# Altium schematic sheet [1] NAND FLASH and SDRAM.SchDoc
size A4
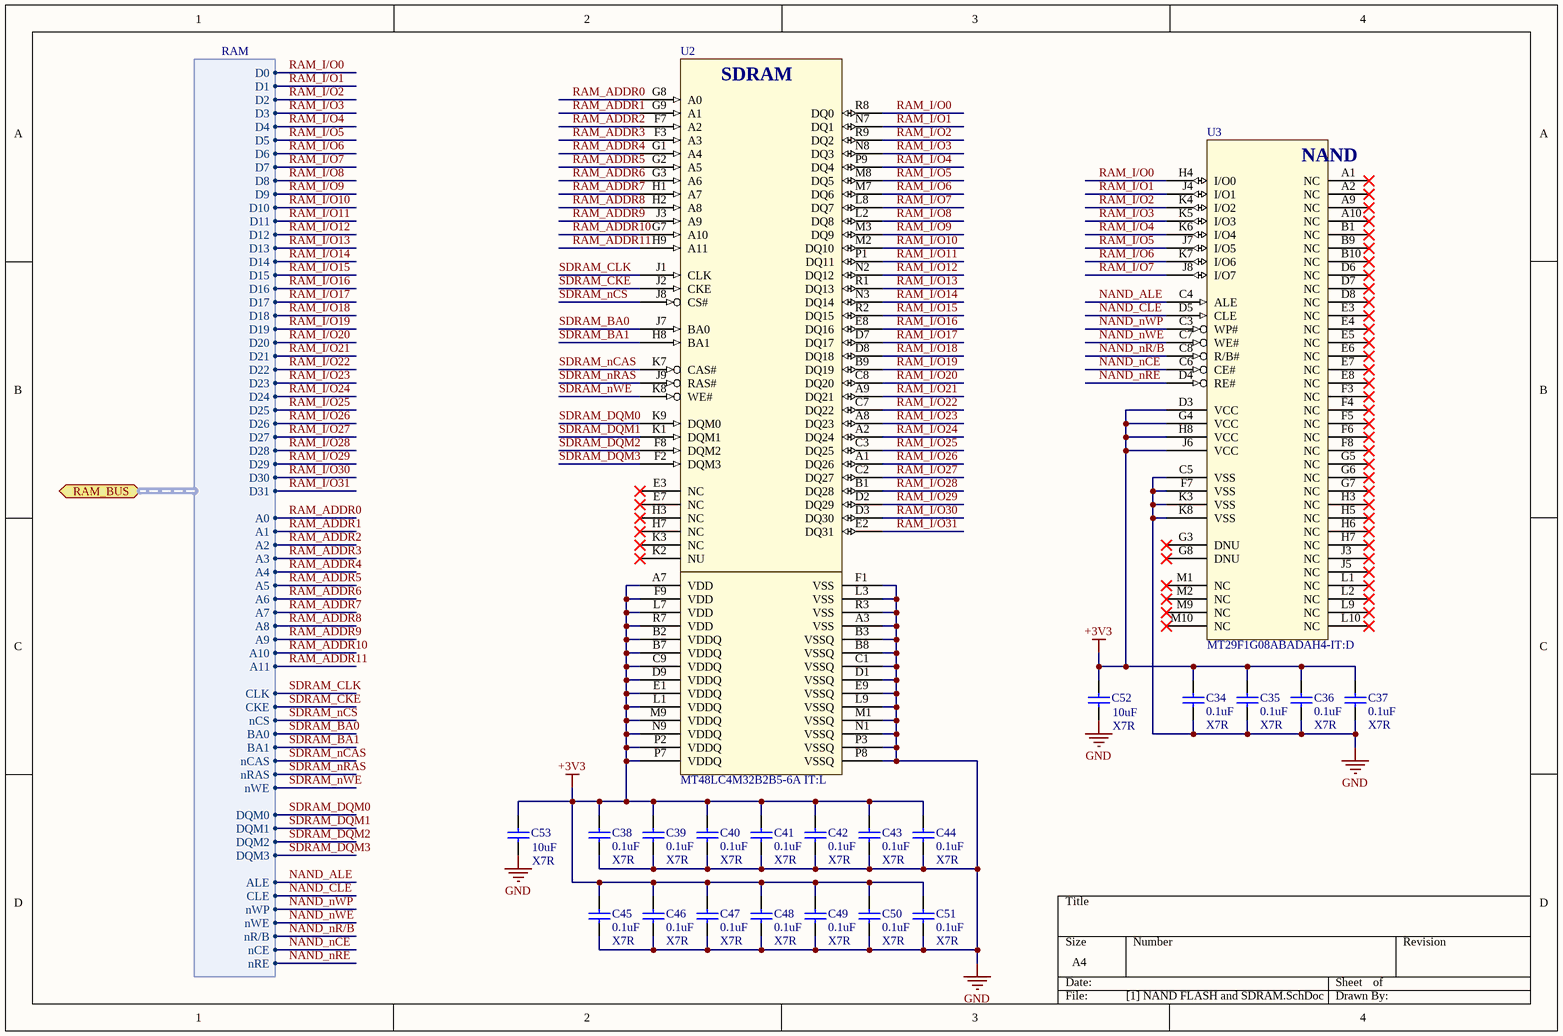
[diagram p0: [1] NAND FLASH and SDRAM.SchDoc]

## Parts
C34  value 0.1uF  Type: X7R  [CAP0201]  (hidden comment: ChipCap 0.1u X7R)
C35  value 0.1uF  Type: X7R  [CAP0201]  (hidden comment: ChipCap 0.1u X7R)
C36  value 0.1uF  Type: X7R  [CAP0201]  (hidden comment: ChipCap 0.1u X7R)
C37  value 0.1uF  Type: X7R  [CAP0201]  (hidden comment: ChipCap 0.1u X7R)
C38  value 0.1uF  Type: X7R  [CAP0201]  (hidden comment: ChipCap 0.1u X7R)
C39  value 0.1uF  Type: X7R  [CAP0201]  (hidden comment: ChipCap 0.1u X7R)
C40  value 0.1uF  Type: X7R  [CAP0201]  (hidden comment: ChipCap 0.1u X7R)
C41  value 0.1uF  Type: X7R  [CAP0201]  (hidden comment: ChipCap 0.1u X7R)
C42  value 0.1uF  Type: X7R  [CAP0201]  (hidden comment: ChipCap 0.1u X7R)
C43  value 0.1uF  Type: X7R  [CAP0201]  (hidden comment: ChipCap 0.1u X7R)
C44  value 0.1uF  Type: X7R  [CAP0201]  (hidden comment: ChipCap 0.1u X7R)
C45  value 0.1uF  Type: X7R  [CAP0201]  (hidden comment: ChipCap 0.1u X7R)
C46  value 0.1uF  Type: X7R  [CAP0201]  (hidden comment: ChipCap 0.1u X7R)
C47  value 0.1uF  Type: X7R  [CAP0201]  (hidden comment: ChipCap 0.1u X7R)
C48  value 0.1uF  Type: X7R  [CAP0201]  (hidden comment: ChipCap 0.1u X7R)
C49  value 0.1uF  Type: X7R  [CAP0201]  (hidden comment: ChipCap 0.1u X7R)
C50  value 0.1uF  Type: X7R  [CAP0201]  (hidden comment: ChipCap 0.1u X7R)
C51  value 0.1uF  Type: X7R  [CAP0201]  (hidden comment: ChipCap 0.1u X7R)
C52  value 10uF  Type: X7R  [CAP0805]  (hidden comment: ChipCap 10u X7R)
C53  value 10uF  Type: X7R  [CAP0805]  (hidden comment: ChipCap 10u X7R)
U2  MT48LC4M32B2B5-6A IT:L  [VFBGA-90]
U3  MT29F1G08ABADAH4-IT:D  [VFBGA-63 (H4 9x11)]

## Ports
RAM_BUS (harness RAM)

## Harnesses
RAM: D0, D1, D2, D3, D4, D6, D7, D8, D9, D10, D11, D12, D13, D14, D15, D16, D17, D18, D19, D20, D21, D22, D23, D24, D25, D26, D27, D28, D29, D30, D31, A0, A1, A2, A3, A4, A5, A6, A7, A8, A9, A10, A11, CLK, CKE, nCS, BA0, BA1, nCAS, nRAS, nWE, DQM0, DQM1, DQM2, DQM3, ALE, CLE, nWP, nWE, nR/B, nCE, nRE, D5

## Nets
+3V3: C34.2 C35.2 C36.2 C37.2 C38.2 C39.2 C40.2 C41.2 C42.2 C43.2 C44.2 C45.2 C46.2 C47.2 C48.2 C49.2 C50.2 C51.2 C52.2 C53.2 U2.A7(VDD) U2.B2(VDDQ) U2.B7(VDDQ) U2.C9(VDDQ) U2.D9(VDDQ) U2.E1(VDDQ) U2.F9(VDD) U2.L1(VDDQ) U2.L7(VDD) U2.M9(VDDQ) U2.N9(VDDQ) U2.P2(VDDQ) U2.P7(VDDQ) U2.R7(VDD) U3.D3(VCC) U3.G4(VCC) U3.H8(VCC) U3.J6(VCC)
GND: C34.1 C35.1 C36.1 C37.1 C38.1 C39.1 C40.1 C41.1 C42.1 C43.1 C44.1 C45.1 C46.1 C47.1 C48.1 C49.1 C50.1 C51.1 C52.1 C53.1 U2.A3(VSS) U2.B3(VSSQ) U2.B8(VSSQ) U2.C1(VSSQ) U2.D1(VSSQ) U2.E9(VSSQ) U2.F1(VSS) U2.L3(VSS) U2.L9(VSSQ) U2.M1(VSSQ) U2.N1(VSSQ) U2.P3(VSSQ) U2.P8(VSSQ) U2.R3(VSS) U3.C5(VSS) U3.F7(VSS) U3.K3(VSS) U3.K8(VSS)
NAND_ALE: U3.C4(ALE) ; port RAM_BUS.ALE
NAND_CLE: U3.D5(CLE) ; port RAM_BUS.CLE
NAND_nCE: U3.C6(CE#) ; port RAM_BUS.nCE
NAND_nR/B: U3.C8(R/B#) ; port RAM_BUS.nR/B
NAND_nRE: U3.D4(RE#) ; port RAM_BUS.nRE
NAND_nWE: U2.K8(WE#) U3.C7(WE#) ; port RAM_BUS.nWE  [also labelled SDRAM_nWE]
NAND_nWP: U3.C3(WP#) ; port RAM_BUS.nWP
RAM_ADDR0: U2.G8(A0) ; port RAM_BUS.A0
RAM_ADDR1: U2.G9(A1) ; port RAM_BUS.A1
RAM_ADDR2: U2.F7(A2) ; port RAM_BUS.A2
RAM_ADDR3: U2.F3(A3) ; port RAM_BUS.A3
RAM_ADDR4: U2.G1(A4) ; port RAM_BUS.A4
RAM_ADDR5: U2.G2(A5) ; port RAM_BUS.A5
RAM_ADDR6: U2.G3(A6) ; port RAM_BUS.A6
RAM_ADDR7: U2.H1(A7) ; port RAM_BUS.A7
RAM_ADDR8: U2.H2(A8) ; port RAM_BUS.A8
RAM_ADDR9: U2.J3(A9) ; port RAM_BUS.A9
RAM_ADDR10: U2.G7(A10) ; port RAM_BUS.A10
RAM_ADDR11: U2.H9(A11) ; port RAM_BUS.A11
RAM_I/O0: U2.R8(DQ0) U3.H4(I/O0) ; port RAM_BUS.D0
RAM_I/O1: U2.N7(DQ1) U3.J4(I/O1) ; port RAM_BUS.D1
RAM_I/O2: U2.R9(DQ2) U3.K4(I/O2) ; port RAM_BUS.D2
RAM_I/O3: U2.N8(DQ3) U3.K5(I/O3) ; port RAM_BUS.D3
RAM_I/O4: U2.P9(DQ4) U3.K6(I/O4) ; port RAM_BUS.D4
RAM_I/O5: U2.M8(DQ5) U3.J7(I/O5) ; port RAM_BUS.D5
RAM_I/O6: U2.M7(DQ6) U3.K7(I/O6) ; port RAM_BUS.D6
RAM_I/O7: U2.L8(DQ7) U3.J8(I/O7) ; port RAM_BUS.D7
RAM_I/O8: U2.L2(DQ8) ; port RAM_BUS.D8
RAM_I/O9: U2.M3(DQ9) ; port RAM_BUS.D9
RAM_I/O10: U2.M2(DQ10) ; port RAM_BUS.D10
RAM_I/O11: U2.P1(DQ11) ; port RAM_BUS.D11
RAM_I/O12: U2.N2(DQ12) ; port RAM_BUS.D12
RAM_I/O13: U2.R1(DQ13) ; port RAM_BUS.D13
RAM_I/O14: U2.N3(DQ14) ; port RAM_BUS.D14
RAM_I/O15: U2.R2(DQ15) ; port RAM_BUS.D15
RAM_I/O16: U2.E8(DQ16) ; port RAM_BUS.D16
RAM_I/O17: U2.D7(DQ17) ; port RAM_BUS.D17
RAM_I/O18: U2.D8(DQ18) ; port RAM_BUS.D18
RAM_I/O19: U2.B9(DQ19) ; port RAM_BUS.D19
RAM_I/O20: U2.C8(DQ20) ; port RAM_BUS.D20
RAM_I/O21: U2.A9(DQ21) ; port RAM_BUS.D21
RAM_I/O22: U2.C7(DQ22) ; port RAM_BUS.D22
RAM_I/O23: U2.A8(DQ23) ; port RAM_BUS.D23
RAM_I/O24: U2.A2(DQ24) ; port RAM_BUS.D24
RAM_I/O25: U2.C3(DQ25) ; port RAM_BUS.D25
RAM_I/O26: U2.A1(DQ26) ; port RAM_BUS.D26
RAM_I/O27: U2.C2(DQ27) ; port RAM_BUS.D27
RAM_I/O28: U2.B1(DQ28) ; port RAM_BUS.D28
RAM_I/O29: U2.D2(DQ29) ; port RAM_BUS.D29
RAM_I/O30: U2.D3(DQ30) ; port RAM_BUS.D30
RAM_I/O31: U2.E2(DQ31) ; port RAM_BUS.D31
SDRAM_BA0: U2.J7(BA0) ; port RAM_BUS.BA0
SDRAM_BA1: U2.H8(BA1) ; port RAM_BUS.BA1
SDRAM_CKE: U2.J2(CKE) ; port RAM_BUS.CKE
SDRAM_CLK: U2.J1(CLK) ; port RAM_BUS.CLK
SDRAM_DQM0: U2.K9(DQM0) ; port RAM_BUS.DQM0
SDRAM_DQM1: U2.K1(DQM1) ; port RAM_BUS.DQM1
SDRAM_DQM2: U2.F8(DQM2) ; port RAM_BUS.DQM2
SDRAM_DQM3: U2.F2(DQM3) ; port RAM_BUS.DQM3
SDRAM_nCAS: U2.K7(CAS#) ; port RAM_BUS.nCAS
SDRAM_nCS: U2.J8(CS#) ; port RAM_BUS.nCS
SDRAM_nRAS: U2.J9(RAS#) ; port RAM_BUS.nRAS

Not connected (* = marked no-connect by the designer): U2 E3(NC)* E7(NC)* H3(NC)* H7(NC)* K2(NU)* K3(NC)*; U3 A1(NC)* A2(NC)* A9(NC)* A10(NC)* B1(NC)* B9(NC)* B10(NC)* D6(NC)* D7(NC)* D8(NC)* E3(NC)* E4(NC)* E5(NC)* E6(NC)* E7(NC)* E8(NC)* F3(NC)* F4(NC)* F5(NC)* F6(NC)* F8(NC)* G3(DNU)* G5(NC)* G6(NC)* G7(NC)* G8(DNU)* H3(NC)* H5(NC)* H6(NC)* H7(NC)* J3(NC)* J5(NC)* L1(NC)* L2(NC)* L9(NC)* L10(NC)* M1(NC)* M2(NC)* M9(NC)* M10(NC)*

## Notes on the sheet
- (in symbol MT29F1G08ABADAH4-IT:D) NAND
- (in symbol MT48LC4M32B2B5-6A IT:L) SDRAM

## Library data of the parts
C34-C51 = ChipCap 0.1uF X7R: Surface-mount ceramic multilayer capacitor; Manufacturer: YAGEO; Voltage: 100V; Tolerance: 10%; ComponentLink1Description: Datasheet; ComponentLink1URL: http://www.deaha.com/pdf/YAGEO-CC_series.pdf
C52 C53 = ChipCap 10uF X7R: Surface-mount ceramic multilayer capacitor; Manufacturer: YAGEO; Voltage: 25V; Tolerance: 10%; ComponentLink1Description: Datasheet; ComponentLink1URL: http://www.deaha.com/pdf/YAGEO-CC_series.pdf
U2 = MT48LC4M32B2B5-6A IT:L: SDRAM 128Mbit
U3 = MT29F1G08ABADAH4-IT:D: FLASH RAM 1Gbit